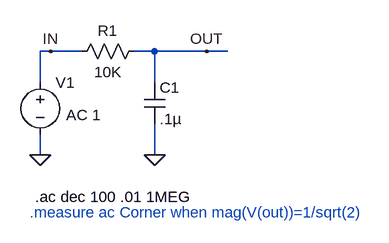
[diagram p0: schematic RCFilterACAnalysis.asc]
RCFilterACAnalysis.asc, the LTspice schematic file:
Version 4.1
SHEET 1 880 680
WIRE 64 160 48 160
WIRE 112 160 64 160
WIRE 224 160 192 160
WIRE 304 160 224 160
WIRE 336 160 304 160
WIRE 48 208 48 160
WIRE 224 208 224 160
WIRE 48 320 48 288
WIRE 224 320 224 272
FLAG 224 320 0
FLAG 48 320 0
FLAG 304 160 OUT
FLAG 64 160 IN
SYMBOL res 208 144 R90
WINDOW 0 0 56 VBottom 2
WINDOW 3 32 56 VTop 2
SYMATTR InstName R1
SYMATTR Value 10K
SYMBOL cap 208 208 R0
SYMATTR InstName C1
SYMATTR Value .1µ
SYMBOL voltage 48 192 R0
WINDOW 3 -13 168 Left 2
WINDOW 123 40 66 Left 2
WINDOW 39 0 0 Left 2
SYMATTR Value ""
SYMATTR Value2 AC 1
SYMATTR InstName V1
TEXT 32 408 Left 2 ;.measure ac Corner when mag(V(out))=1/sqrt(2)
TEXT 40 384 Left 2 !.ac dec 100 .01 1MEG

The netlist it stands for:
* RCFilterACAnalysis.asc
R1 OUT IN 10K
C1 OUT 0 .1µ
V1 IN 0 AC 1
* .measure ac Corner when mag(V(out))=1/sqrt(2)
.ac dec 100 .01 1MEG
.backanno
.end